# Altium project PCB_DYBoard_Transducer_CAN_ADS1113_V1.PrjPcb
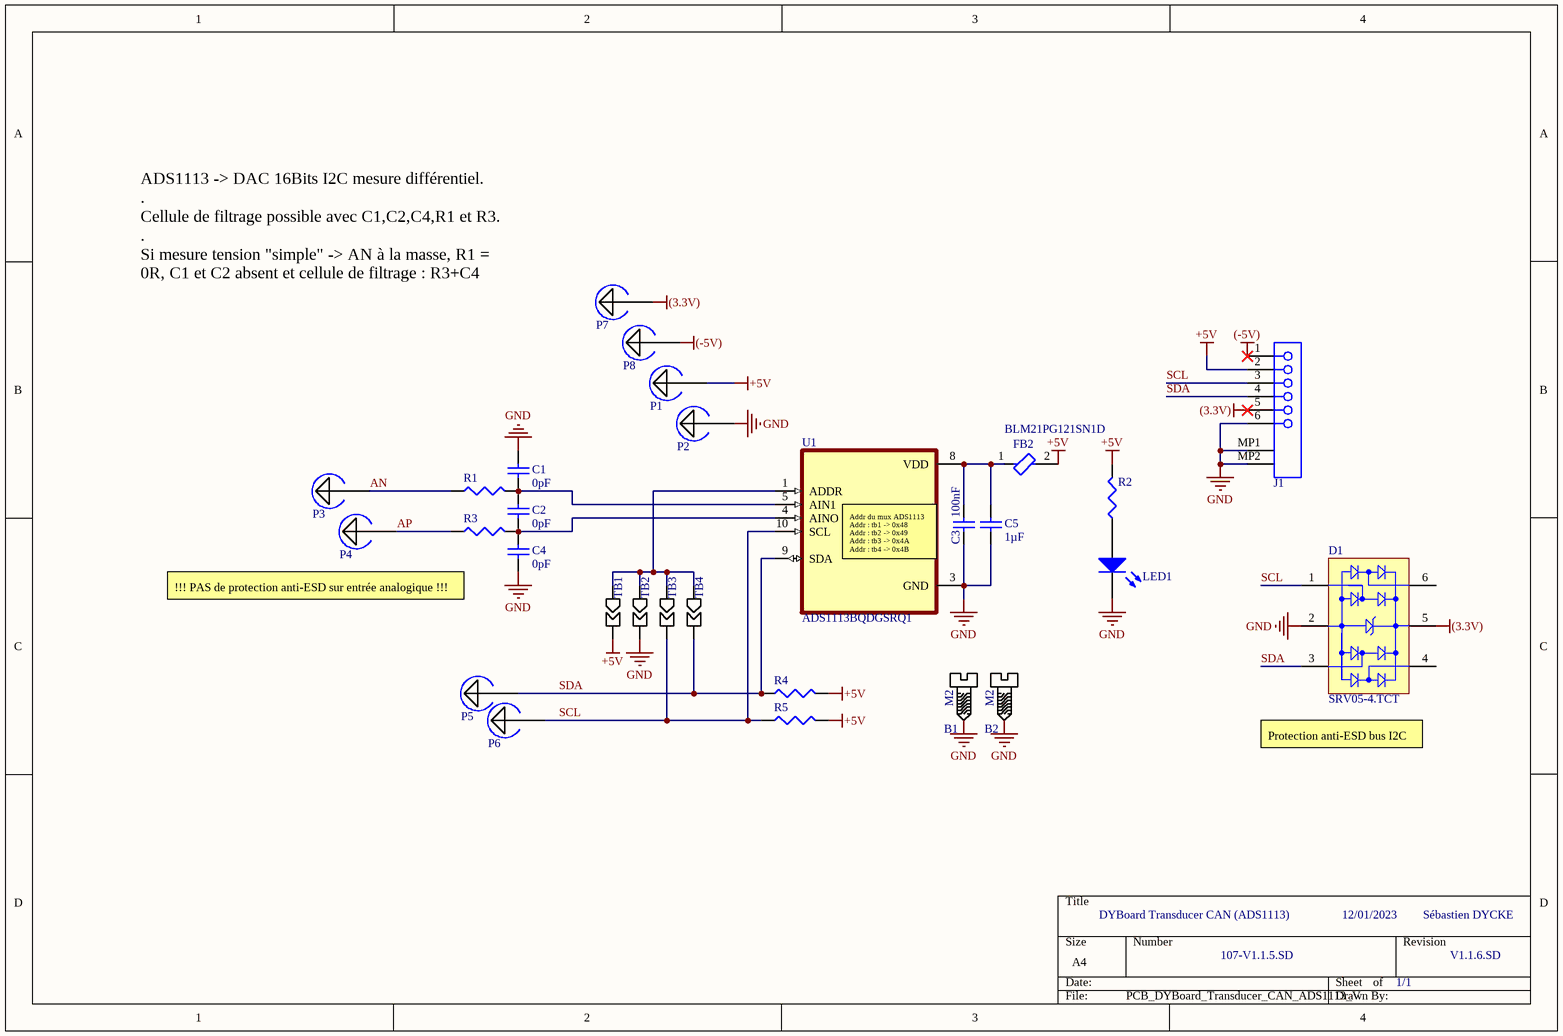
[diagram p0: PCB_DYBoard_Transducer_CAN_ADS1113_V1.SchDoc]
1 sheet, 29 parts. Net scope: global (net labels, ports and power ports of the same name join across sheets).
Board file: PCB_DYBoard_Transducer_CAN_ADS1113_V1.PcbDoc

## Sheet PCB_DYBoard_Transducer_CAN_ADS1113_V1.SchDoc
size A4; SheetNumber: 1; SheetTotal: 1

### Parts
B1  bolt_M2  [bolt_M2]  (value not drawn)
B2  bolt_M2  [bolt_M2]  (value not drawn)
C1  value 0pF  [1608[0603]]  (hidden comment: Cap Semi)
C2  value 0pF  [1608[0603]]  (hidden comment: Cap Semi)
C3  value 100nF  [1608[0603]]  (hidden comment: Cap Semi)
C4  value 0pF  [1608[0603]]  (hidden comment: Cap Semi)
C5  value 1µF  [1608[0603]]  (hidden comment: Cap Semi)
D1  SRV05-4.TCT  [SMTC-SOT23-6_V]
FB2  BLM21PG121SN1D  [FP-BLM21-0_2-t0_85-e0_5-d-IPC_C]
J1  SEB_MOLeX_6p  [SEB_MOLeX_6p]  (value not drawn)
LED1  150060BS75000  [0603_A]  (value not drawn)
P1  solderPad  [solderPad_2]  (value not drawn)
P2  solderPad  [solderPad_2]  (value not drawn)
P3  solderPad  [solderPad_2]  (value not drawn)
P4  solderPad  [solderPad_2]  (value not drawn)
P5  solderPad  [solderPad_2]  (value not drawn)
P6  solderPad  [solderPad_2]  (value not drawn)
P7  solderPad  [solderPad_2]  (value not drawn)
P8  solderPad  [solderPad_2]  (value not drawn)
R1  Res3  [J1-0603]  (value not drawn)
R2  Res3  [J1-0603]  (value not drawn)
R3  Res3  [J1-0603]  (value not drawn)
R4  Res3  [J1-0603]  (value not drawn)
R5  Res3  [J1-0603]  (value not drawn)
TB1  tin_bridge  [tin_bridge]  (value not drawn)
TB2  tin_bridge  [tin_bridge]  (value not drawn)
TB3  tin_bridge  [tin_bridge]  (value not drawn)
TB4  tin_bridge  [tin_bridge]  (value not drawn)
U1  ADS1113BQDGSRQ1  [SOP50P490X110-10N]

### Nets
(3.3V): D1.5(VBUS) J1.5 P7.20
(-5V): J1.1 P8.20
+5V: FB2.2 J1.2 P1.20 R2.2 R4.2 R5.2 TB1.22
GND: B1.20 B2.20 C1.2 C3.1 C4.1 C5.1 D1.2(GND) J1.6 J1.MP1 J1.MP2 LED1.1(K) P2.20 TB2.22 U1.3(GND)
AN: P3.20 R1.1
AP: P4.20 R3.1
SCL: D1.1(I/O_1) J1.3 P6.20 R5.1 TB3.22 U1.10(SCL)
SDA: D1.3(I/O_2) J1.4 P5.20 R4.1 TB4.22 U1.9(SDA)
NetC1_1: C1.1 C2.2 R1.2 U1.5(AIN1)
NetC2_1: C2.1 C4.2 R3.2 U1.4(AINO)
NetC3_2: C3.2 C5.2 FB2.1 U1.8(VDD)
NetLED1_2: LED1.2(A) R2.1
NetTB1_21: TB1.21 TB2.21 TB3.21 TB4.21 U1.1(ADDR)

Not connected (* = marked no-connect by the designer): D1 4(I/O_3) 6(I/O_4)

### Notes on the sheet
- ADS1113 -> DAC 16Bits I2C mesure différentiel.                .                                                                                         Cellule de filtrage possible avec C1,C2,C4,R1 et R3. .                                                                                                         Si mesure tension "simple" -> AN à la masse, R1 = 0R, C1 et C2 absent et cellule de filtrage : R3+C4
- (near U1) Addr du mux ADS1113  Addr : tb1 -> 0x48                 Addr : tb2 -> 0x49                 Addr : tb3 -> 0x4A                 Addr : tb4 -> 0x4B
- !!! PAS de protection anti-ESD sur entrée analogique !!!
- Protection anti-ESD bus I2C
- DYBoard Transducer CAN (ADS1113)
- 12/01/2023
- Sébastien DYCKE
- 107-V1.1.5.SD
- 1/1
- V1.1.6.SD
- (in symbol bolt_M2) M2

### Library data of the parts
C1-C5 = Cap Semi: Capacitor (Semiconductor SIM Model); Published: 8-Jun-2000; LatestRevisionDate: 29-May-2009; LatestRevisionNote: IPC-7351 Footprint Added.; PackageReference: C1206; Publisher: Altium Limited; PackageDescription: Chip Capacitor
D1 = CMP-2000-05358-1: RailClamp(R) Low Capacitance TVS Diode Array, 5 pF, 17.5 VC, -55 to 125 degC, 6-Pin SOT23, RoHS, Tape and Reel; Manufacturer: Semtech; Leakage Current (Max): 5uA; Polarity: Uni-Directional; Peak Pulse Power Dissipation: 300W; Clamping Voltage: 17.5V; Number of Elements: 1; Working Voltage: 5V; Test Current (It): 1mA; Configuration: Quad; Reverse Breakdown Voltage: 6V; Suppressor Type: DiodeArrays; Peak Pulse Current: 12A; Product Depth (mm): 1.6mm; Product Height (mm): 1.15mm; Clamping Voltage (Max): 12.5V; Rad Hardened: No; Product Length (mm): 2.9mm; Capacitance Value: 5pF; Mounting: SurfaceMount; Datasheet URL: https://datasheet.ciiva.com/8029/srv05-4-8029973.pdf; Datasheet Version: Jan-08; Packaging: TapeandReel; Package / Case: SOT-23; Operating Temp Range: -55Cto125C; Pin Count: 6; Direction Type: Uni-Directional; Operating Temperature Min Deg. C: -55C; Reverse Stand-off Voltage: 5V; Leakage Current: 5uA; Manufacturer URL: http://www.semtech.com/; Working Voltage (Max): 5V; Package Reference: SOT23-6; Package Description: 6-Pin Small Outline Transistor, Body 2.9 x 1.6 mm, Pitch 0.95 mm; Operating Temperature Max Deg. C: 125C; Operating Temperature Classification: Military; Mounting Style: SurfaceMount
FB2 = CMP-0686-00612-3: Chip Ferrite Bead, 0805, 120Ω @ 100MHz, 0.03Ω, 25%, 3A; Impedance: 120R; Number of Circuits: 1; Material: Steel; DC Resistance (DCR): 30mR; Package Quantity: 1; Lead Free: Lead Free; Width: 1.25mm; Number of Pins: 2; Depth: 1.25mm; Case Code (Imperial): 0805; Tolerance: 25%; Current Rating: 3A; Test Frequency: 100MHz; Length: 2mm; Min Operating Temperature: -55°C; Max Current Rating: 3A; REACH SVHC: No SVHC; Series: BLM21P; Height: 0.85mm; Max DC Current: 3A; Termination: SMD/SMT; Max Operating Temperature: 125°C; Number of Lines: 1; Case/Package: 0805; RoHS Compliant: Yes; Packaging: Tape and Reel; Case Code (Metric): 2012; DC Resistance-Max: 30mR
LED1 = CMP-1426-00003-1: SMD mono-color Chip LED, WL-SMCW, Blue; Manufacturer: Wuerth Elektronik; Color: Blue; ComponentLink2Description: Datasheet; ComponentLink2URL: http://katalog.we-online.com/led/datasheet/150060BS75000.pdf; ComponentLink1URL: http://www.we-online.com; PackageReference: 0603_A; PartNumber: 150060BS75000; ComponentLink1Description: Manufacturer URL
R1-R5 = Res3: Resistor; Published: 8-Jun-2000; LatestRevisionDate: 29-May-2009; LatestRevisionNote: IPC-7351 Footprint Added.; PackageReference: J1-0603; Publisher: Altium Limited; PackageDescription: Chip Resistor
U1 = ADS1113BQDGSRQ1: Package: None; Price: None; Value: *; MP: ADS1113BQDGSRQ1; Availability: Unavailable